# EAGLE design LoRaPi (EAGLE 9.6.2)
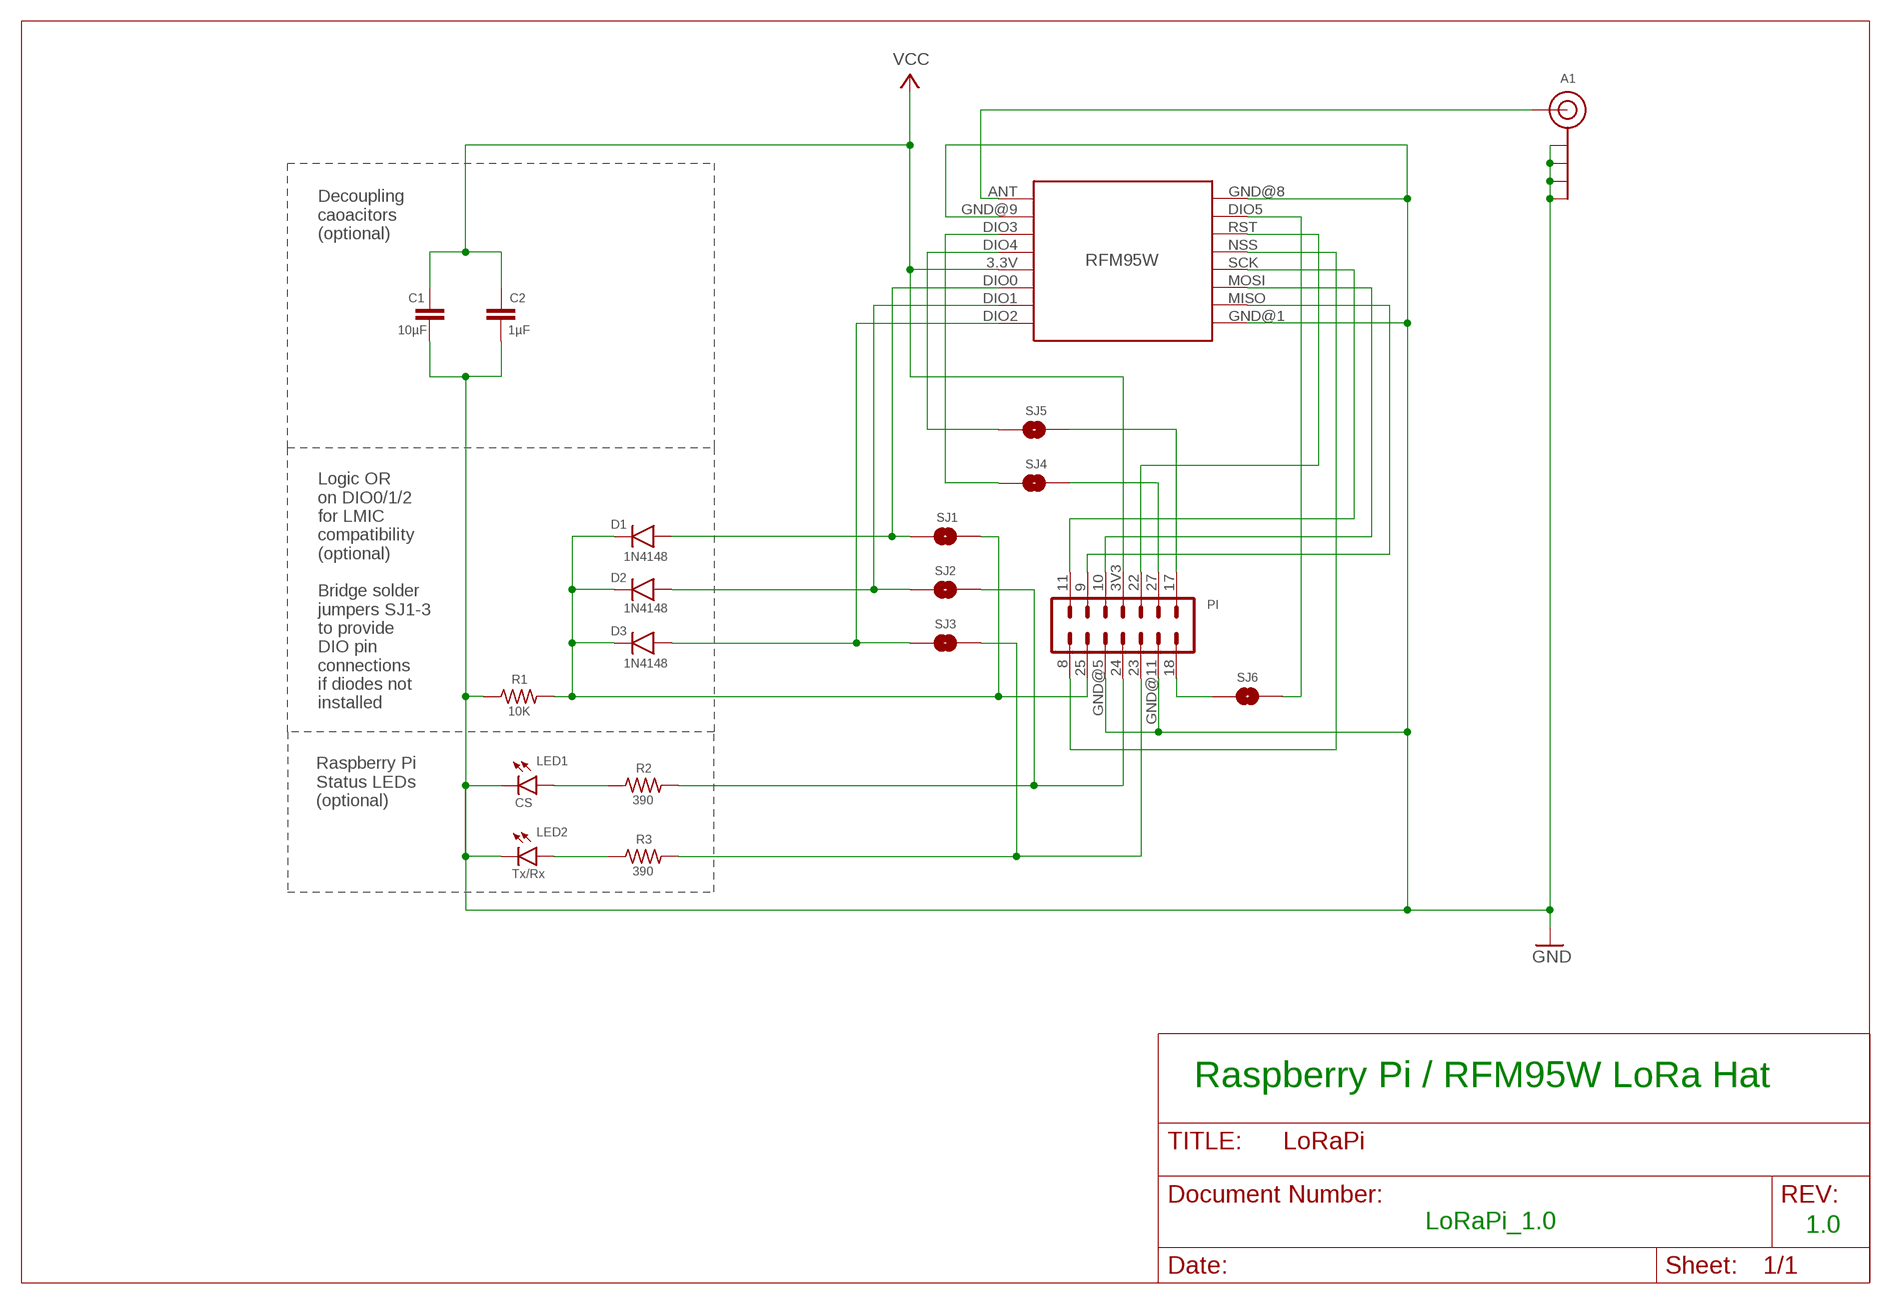
[diagram p0: schematic, sheet 1]

## Parts
A1  U.FL-SMA-EDGE-COMBO  [U.FL-SMA-EDGE-COMBO]
C1  10µF  CAPACITOR  [C0805]
C2  1µF  CAPACITOR  [C0805]
D1  1N4148  1N4148SMD  [SOD-123]
D2  1N4148  1N4148SMD  [SOD-123]
D3  1N4148  1N4148SMD  [SOD-123]
LED1  CS  LEDCHIP-LED0805  [CHIP-LED0805]
LED2  Tx/Rx  LEDCHIP-LED0805  [CHIP-LED0805]
PI  2X7-PIN-HEADER  [2X7]
R1  10K  R-US_R0805  [R0805]
R2  390  R-US_R0805  [R0805]
R3  390  R-US_R0805  [R0805]
RFM95W  RFM95W-LORA  [RFM95W-LORA]
SJ1  SJ  [SJ]
SJ2  SJ  [SJ]
SJ3  SJ  [SJ]
SJ4  SJ  [SJ]
SJ5  SJ  [SJ]
SJ6  SJ  [SJ]

## Nets
GND: A1.GND@1A(GND) A1.GND@1B(GND) A1.GND@2A(GND) A1.GND@2B(GND) C1.2 C2.2 LED1.C LED2.C PI.GND@5(GND) PI.GND@11(GND) R1.1 RFM95W.GND@1(GND.1) RFM95W.GND@8(GND.2) RFM95W.GND@9(GND.3)
N$1: LED2.A R3.1
N$2: LED1.A R2.1
N$3: PI.18 SJ6.1
N$4: PI.8 RFM95W.NSS
N$5: PI.23 R3.2 SJ3.2
N$6: PI.24 R2.2 SJ2.2
N$7: D1.2 RFM95W.DIO0 SJ1.1
N$8: RFM95W.DIO4 SJ5.1
N$9: RFM95W.DIO3 SJ4.1
N$10: D1.1 D2.1 D3.1 PI.25 R1.2 SJ1.2
N$11: A1.SIG RFM95W.ANT
N$12: D2.2 RFM95W.DIO1 SJ2.1
N$13: PI.22 RFM95W.RST
N$14: D3.2 RFM95W.DIO2 SJ3.1
N$15: PI.11 RFM95W.SCK
N$16: PI.10 RFM95W.MOSI
N$17: PI.9 RFM95W.MISO
N$18: PI.27 SJ4.2
N$19: PI.17 SJ5.2
N$20: RFM95W.DIO5 SJ6.2
VCC: C1.1 C2.1 PI.3V3 RFM95W.3.3V

## Notes on the sheet
- Decoupling
  caoacitors
  (optional)
- Logic OR
  on DIO0/1/2
  for LMIC
  compatibility
  (optional)
  
  Bridge solder
  jumpers SJ1-3
  to provide
  DIO pin
  connections
  if diodes not
  installed
- Raspberry Pi
  Status LEDs
  (optional)
- Raspberry Pi / RFM95W LoRa Hat
- LoRaPi_1.0 | 1.0

## Library data of the parts
A1 = digitalconcepts:U.FL-SMA-EDGE-COMBO: Combination u.FL & SMA edge mount antenna
C1 C2 = digitalconcepts:CAPACITOR: 0805 Capacitor
D1-D3 = digitalconcepts:1N4148: 1N4148 SOD-123 Signal Diode
LED1 LED2 = led:LED: LED OSRAM: - CHIPLED LG R971, LG N971, LY N971, LG Q971, LY Q971, LO R971, LY R971 LH N974, LH R974 LS Q976, LO Q976, LY Q976 LO Q996 - Hyper CHIPLED LW Q18S LB Q993, LB Q99A, LB R99A - SideLED LS A670, LO A670, LY A670, LG A670, LP A670 LB A673, LV A673, LT A673, LW A673 LH A674 LY A675 LS A676, LA A676, LO A676, LY A676, LW A676 LS A679, LY A679, LG A679 - Hyper Micro SIDELED® LS Y876, LA Y876, LO Y876, LY Y876 LT Y87S - SmartLED LW L88C, LW L88S LB L89C, LB L89S, LG L890 LS L89K, LO L89K, LY L89K LS L896, LA L896, LO L896, LY L896 - TOPLED LS T670, LO T670, LY T670, LG T670, LP T670 LSG T670, LSP T670, LSY T670, LOP T670, LYG T670 LG T671, LOG T671, LSG T671 LB T673, LV T673, LT T673, LW T673 LH T674 LS T676, LA T676, LO T676, LY T676, LB T676, LH T676, LSB T676, LW T676 LB T67C, LV T67C, LT T67C, LS T67K, LO T67K, LY T67K, LW E67C LS E67B, LA E67B, LO E67B, LY E67B, LB E67C, LV E67C, LT E67C LW T67C LS T679, LY T679, LG T679 LS T770, LO T770, LY T770, LG T770, LP T770 LB T773, LV T773, LT T773, LW T773 LH T774 LS E675, LA E675, LY E675, LS T675 LS T776, LA T776, LO T776, LY T776, LB T776 LHGB T686 LT T68C, LB T68C - Hyper Mini TOPLED® LB M676 - Mini TOPLED Santana® LG M470 LS M47K, LO M47K, LY M47K Source: http://www.osram.convergy.de LUXEON: - LUMILED® LXK2-PW12-R00, LXK2-PW12-S00, LXK2-PW14-U00, LXK2-PW14-V00 LXK2-PM12-R00, LXK2-PM12-S00, LXK2-PM14-U00 LXK2-PE12-Q00, LXK2-PE12-R00, LXK2-PE12-S00, LXK2-PE14-T00, LXK2-PE14-U00 LXK2-PB12-K00, LXK2-PB12-L00, LXK2-PB12-M00, LXK2-PB14-N00, LXK2-PB14-P00, LXK2-PB14-Q00 LXK2-PR12-L00, LXK2-PR12-M00, LXK2-PR14-Q00, LXK2-PR14-R00 LXK2-PD12-Q00, LXK2-PD12-R00, LXK2-PD12-S00 LXK2-PH12-R00, LXK2-PH12-S00 LXK2-PL12-P00, LXK2-PL12-Q00, LXK2-PL12-R00 Source: www.luxeon.com KINGBRIGHT: KA-3528ASYC Source: www.kingbright.com
PI = digitalconcepts:2X7-PIN-HEADER: Double Row 14-Pin Header
R1-R3 = digitalconcepts:R-US_: RESISTOR, American symbol; SPICEPREFIX: R
RFM95W = digitalconcepts:RFM95W-LORA: RFM95W LoRa Wireless Transceiver
SJ1-SJ6 = digitalconcepts:SJ: Solder Jumper

## Board
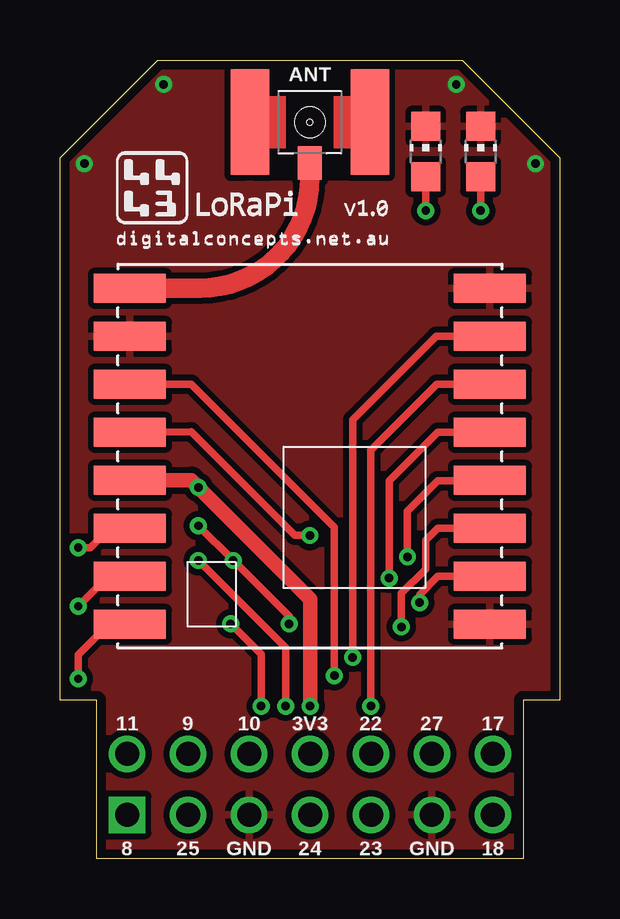
[diagram p1: board, top side]
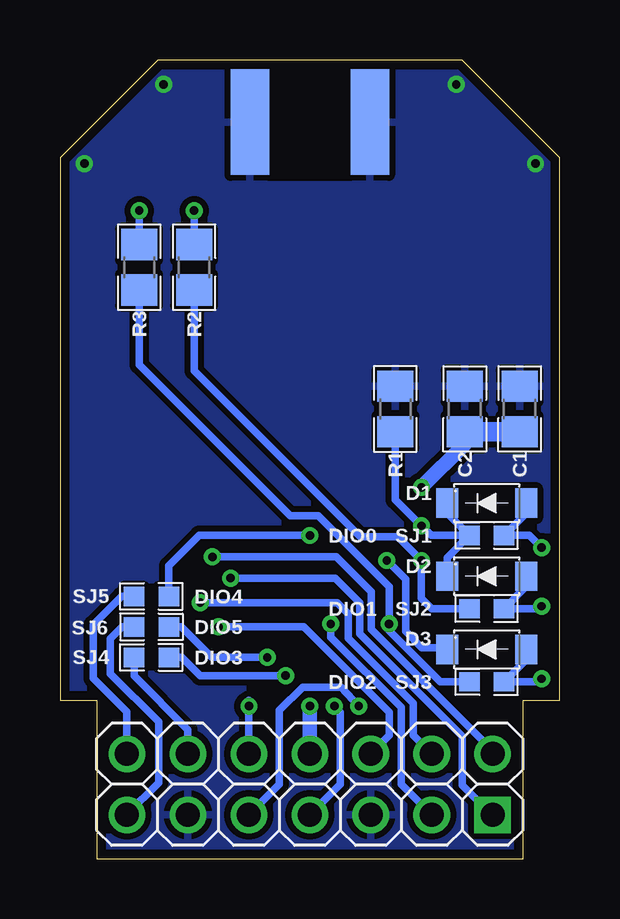
[diagram p2: board, bottom side, seen from below]

Size 20.83 x 33.27 mm. Coordinates in mm from the lower left corner, seen from the top.
Outline: 0,6.6 0,29.21 4.06,33.27 16.76,33.27 20.83,29.21 20.83,6.6 19.3,6.6 19.3,0 1.52,0 1.52,6.6 0,6.6
Copper layers (1*16): Top 0.0356mm / dielectric 1.5011mm / Bottom 0.0356mm
Design rules "PCBs_io": minimum track width 6mil, minimum drill 13mil, track to track 6mil, track to pad 6mil, pad to pad 6mil, via to via 6mil, smd to smd 6mil, copper to edge 15mil, drill to drill 6mil, minimum pad ring 7mil, minimum via ring 7mil, stop-mask expansion 3mil, vias tented up to drill 0mil, thermal gap 10mil

### Footprints (pad centres in the part's own frame; a part is rotated, then mirrored left to right if it is on the bottom)
U.FL-SMA-EDGE-COMBO = smd 1.6 x 4.4: GND@1A -2.5,0; GND@2A 2.5,0 | smd 1.6 x 4.4 bottom: GND@1B -2.5,0; GND@2B 2.5,0 | smd 1 x 1.4: SIG 0,-1.7
C0805 = smd 1.3 x 1.5: 1 -0.95,0; 2 0.95,0
SOD-123 = smd 0.91 x 1.22: 1 1.65,0; 2 -1.65,0
CHIP-LED0805 = smd 1.2 x 1.2: A 0,-1.05; C 0,1.05
2X7 = drill 1 pad 1.524: 3V3 7.62,2.54; 9 2.54,2.54; 10 5.08,2.54; 11 0,2.54; 17 15.24,2.54; 18 15.24,0; 22 10.16,2.54; 23 10.16,0; 24 7.62,0; 25 2.54,0; 27 12.7,2.54; GND@5 5.08,0; GND@11 12.7,0 | drill 1 pad 1.524 square: 8 0,0
R0805 = smd 1.3 x 1.5: 1 -0.95,0; 2 0.95,0
RFM95W-LORA = smd 3 x 1.2: 3.3V 7.5,1; ANT 7.5,-7; DIO0 7.5,3; DIO1 7.5,5; DIO2 7.5,7; DIO3 7.5,-3; DIO4 7.5,-1; DIO5 -7.5,-5; GND@1 -7.5,7; GND@8 -7.5,-7; GND@9 7.5,-5; MISO -7.5,5; MOSI -7.5,3; NSS -7.5,-1; RST -7.5,-3; SCK -7.5,1
SJ = smd 0.85 x 0.8: 1 -0.725,0; 2 0.725,0

### Placement (x,y rotation side)
A1  10.41,30.68 0 top
C1  1.68,18.74 90 bottom
C2  3.96,18.74 90 bottom
D1  3.05,14.81 180 bottom
D2  3.05,11.76 180 bottom
D3  3.05,8.71 180 bottom
LED1  15.24,29.46 0 top
LED2  17.53,29.46 0 top
PI  2.8,1.82 0 top
R1  6.86,18.74 270 bottom
R2  15.24,24.64 270 bottom
R3  17.53,24.64 270 bottom
RFM95W  10.41,16.76 180 top
SJ1  3.05,13.46 180 bottom
SJ2  3.05,10.41 180 bottom
SJ3  3.05,7.37 180 bottom
SJ4  17.02,8.38 180 bottom
SJ5  17.02,10.92 180 bottom
SJ6  17.02,9.65 0 bottom

### Tracks (layer width: path | path; a pad name or v marks a point on that pad's centre or on a via)
GND  (via drill 0.35)
  other vias: 1.02,28.96 4.32,32.26 16.51,32.26 19.81,28.96
  pour Top (isolate 0.254): 4.06,33.27 16.76,33.27 20.83,29.21 20.83,6.6 19.3,6.6 19.3,0 1.52,0 1.52,6.6 0,6.6 0,29.21
  pour Bottom (isolate 0.254): 4.06,33.27 16.76,33.27 20.83,29.21 20.83,6.6 19.3,6.6 19.3,0 1.52,0 1.52,6.6 0,6.6 0,29.21
N$1  (via drill 0.35)
  Top 0.305: LED2.A v17.53,27
  Bottom 0.305: R3.1 v17.53,27
N$2  (via drill 0.35)
  Top 0.305: LED1.A v15.24,27
  Bottom 0.305: R2.1 v15.24,27
N$3
  Bottom 0.305: PI.18 18.04,1.84 16.72,3.16 16.72,5.69 18.73,7.7 18.73,9.16 18.24,9.65 SJ6.1
N$4  (via drill 0.35)
  Top 0.305: v13.72,11.68 13.72,15.75 15.73,17.76 RFM95W.NSS
  Bottom 0.305: v13.72,11.68 9.36,11.68 8.34,10.67 8.34,9.37 4.06,5.09 4.06,3.05 2.84,1.82 PI.8
N$5  (via drill 0.35)
  Top 0.305: v7.11,9.78 8.38,8.51 v8.38,6.35
  Bottom 0.305: SJ3.2 4.99,7.37 7.11,9.49 v7.11,9.78 7.11,11.32 10.07,14.28 11.23,14.28 17.53,20.57 R3.2 | PI.23 11.68,3.1 11.68,6.17 10.72,7.13 9.12,7.13 v8.38,6.35
N$6  (via drill 0.35)
  Top 0.305: v5.77,12.42 9.4,8.79 v9.4,6.35
  Bottom 0.305: SJ2.2 5.33,10.41 5.77,10.85 v5.77,12.42 6.75,13.41 8.32,13.41 15.24,20.32 R2.2 | PI.24 9.14,3.1 9.14,6.1 v9.4,6.35
N$7  (via drill 0.35)
  Top 0.305: 2.03,13.76 2.03,13.72 1.27,12.95 v0.76,12.95
  Top 0.406: 2.03,13.76 RFM95W.DIO0
  Bottom 0.305: v0.76,12.95 1.27,13.46 SJ1.1 1.4,14.39 D1.2
N$8  (via drill 0.35)
  Top 0.305: RFM95W.DIO4 5.47,17.78 9.79,13.46 v10.41,13.46
  Bottom 0.305: v10.41,13.46 15.03,13.46 16.29,12.2 SJ5.1
N$9  (via drill 0.35)
  Top 0.305: v11.43,7.62 11.43,13.8 5.47,19.76 RFM95W.DIO3
  Bottom 0.305: SJ4.1 15.75,8.38 14.99,7.62 v11.43,7.62
N$10  (via drill 0.35)
  Top 0.305: v5.77,13.87 v7.21,12.42 9.55,10.09 v9.55,9.78
  Bottom 0.152: D3.1 4.76,8.78
  Bottom 0.305: v9.55,9.78 9.55,9.22 6.62,6.29 6.62,3.1 PI.25 | SJ1.2 4.7,12.54 D2.1 | D1.1 4.7,14.39 SJ1.2 | 4.76,8.78 5.75,8.78 6.43,9.46 6.43,11.64 v7.21,12.42 | R1.2 6.86,14.96 v5.77,13.87 5.36,13.46 SJ1.2
N$11
  Top 0.813: A1.SIG 10.41,28.48 10.4,28.34 arc-90 5.82,23.76 RFM95W.ANT
N$12  (via drill 0.35)
  Top 0.305: RFM95W.DIO1 1.78,11.76 1.78,11.53 v0.76,10.52
  Bottom 0.305: v0.76,10.52 0.86,10.41 SJ2.1 1.4,11.34 D2.2
N$13  (via drill 0.35)
  Top 0.305: v12.95,6.35 12.95,17.02 15.7,19.76 RFM95W.RST
  Bottom 0.305: v12.95,6.35 12.96,6.6 PI.22
N$14  (via drill 0.35)
  Top 0.152: RFM95W.DIO2 2.03,9.76
  Top 0.305: v0.76,7.49 0.76,8.49 2.03,9.76
  Bottom 0.305: v0.76,7.49 0.96,7.37 SJ3.1 1.4,8.29 D3.2
N$15  (via drill 0.35)
  Top 0.305: v14.48,12.57 14.48,14.48 15.75,15.75 17.9,15.75 RFM95W.SCK
  Bottom 0.305: PI.11 2.8,4.49 7.87,9.56 7.87,11.12 9.32,12.57 v14.48,12.57
N$16  (via drill 0.35)
  Top 0.305: RFM95W.MOSI 15.75,13.76 15.24,13.26 15.24,12.06 14.22,11.05 v14.22,9.65
  Bottom 0.305: PI.10 7.11,5.13 7.11,6.1 10.68,9.65 v14.22,9.65
N$17  (via drill 0.35)
  Top 0.305: RFM95W.MISO 15.75,11.76 14.99,11 v14.99,10.67
  Bottom 0.305: v14.99,10.67 9.28,10.67 8.81,10.21 8.81,9.18 6.11,6.47 6.11,5.13 PI.9
N$18
  Bottom 0.305: PI.27 15.5,5.38 17.74,7.62 SJ4.2
N$19
  Bottom 0.305: PI.17 18.04,6.11 19.44,7.51 19.44,9.73 18.25,10.92 SJ5.2
N$20  (via drill 0.35)
  Top 0.305: RFM95W.DIO5 15.67,21.76 12.19,18.29 v12.19,8.38
  Bottom 0.305: SJ6.2 15.78,9.65 14.52,8.38 v12.19,8.38
VCC  (via drill 0.35)
  Top 0.305: 10.42,10.81 10.42,10.8
  Top 0.61: 10.42,10.8 v10.42,6.35 | RFM95W.3.3V 5.47,15.76 v5.77,15.47 10.42,10.81
  Bottom 0.61: C2.1 3.96,17.27 v5.77,15.47 | PI.3V3 v10.42,6.35
  Bottom 0.813: C1.1 C2.1

### Text on the board
tPlace: ANT | 11 | 9 | 10 | 3V3 | 22 | 27 | 17 | 8 | 25 | GND | 24 | 23 | GND | 18
bPlace: DIO0 | DIO4 | DIO1 | DIO5 | DIO3 | DIO2